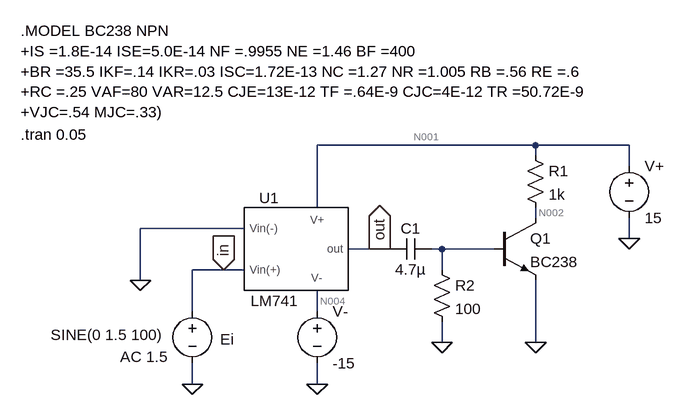
[diagram p0: schematic Schema_4-9.asc]
Schema_4-9.asc, the LTspice schematic file:
Version 4.1
SHEET 1 880 680
WIRE 592 -32 256 -32
WIRE 736 -32 592 -32
WIRE 592 -16 592 -32
WIRE 736 0 736 -32
WIRE 256 64 256 -32
WIRE 592 80 592 64
WIRE 144 96 -16 96
WIRE 736 112 736 80
WIRE 352 128 304 128
WIRE 368 128 352 128
WIRE 448 128 432 128
WIRE 528 128 448 128
WIRE 112 160 64 160
WIRE 144 160 112 160
WIRE 448 160 448 128
WIRE -16 176 -16 96
WIRE 64 224 64 160
WIRE 256 224 256 192
WIRE 448 272 448 240
WIRE 592 272 592 176
WIRE 64 336 64 304
WIRE 256 336 256 304
FLAG 592 272 0
FLAG 448 272 0
FLAG 736 112 0
FLAG 256 336 0
FLAG -16 176 0
FLAG 64 336 0
FLAG 112 160 in
IOPIN 112 160 In
FLAG 352 128 out
IOPIN 352 128 Out
SYMBOL voltage 64 208 R0
WINDOW 0 43 59 Left 2
WINDOW 3 -218 52 Left 2
WINDOW 123 -111 86 Left 2
WINDOW 39 0 0 Left 0
SYMATTR InstName Ei
SYMATTR Value SINE(0 1.5 100)
SYMATTR Value2 AC 1.5
SYMBOL cap 432 112 R90
WINDOW 0 0 32 VBottom 2
WINDOW 3 32 32 VTop 2
SYMATTR InstName C1
SYMATTR Value 4.7µ
SYMBOL voltage 736 -16 R0
SYMATTR InstName V+
SYMATTR Value 15
SYMBOL npn 528 80 R0
SYMATTR InstName Q1
SYMATTR Value BC238
SYMBOL res 576 -32 R0
SYMATTR InstName R1
SYMATTR Value 1k
SYMBOL res 432 144 R0
SYMATTR InstName R2
SYMATTR Value 100
SYMBOL voltage 256 208 R0
SYMATTR InstName V-
SYMATTR Value -15
SYMBOL LM741 192 112 R0
SYMATTR InstName U1
TEXT -200 -208 Left 2 !.MODEL BC238 NPN\n+IS =1.8E-14 ISE=5.0E-14 NF =.9955 NE =1.46 BF =400\n+BR =35.5 IKF=.14 IKR=.03 ISC=1.72E-13 NC =1.27 NR =1.005 RB =.56 RE =.6\n+RC =.25 VAF=80 VAR=12.5 CJE=13E-12 TF =.64E-9 CJC=4E-12 TR =50.72E-9\n+VJC=.54 MJC=.33)
TEXT -200 -48 Left 2 !.tran 0.05

The netlist it stands for:
* Schema_4-9.asc
V§Ei in 0 SINE(0 1.5 100) AC 1.5
C1 N003 out 4.7µ
V+ N001 0 15
Q1 N002 N003 0 0 BC238
R1 N001 N002 1k
R2 N003 0 100
V- N004 0 -15
X§U1 in 0 N001 N004 out LM741  ; pins Vin(+) Vin(-) V+ V- out
.model NPN NPN
.model PNP PNP
.lib standard.bjt
.MODEL BC238 NPN
+IS =1.8E-14 ISE=5.0E-14 NF =.9955 NE =1.46 BF =400
+BR =35.5 IKF=.14 IKR=.03 ISC=1.72E-13 NC =1.27 NR =1.005 RB =.56 RE =.6
+RC =.25 VAF=80 VAR=12.5 CJE=13E-12 TF =.64E-9 CJC=4E-12 TR =50.72E-9
+VJC=.54 MJC=.33)
.tran 0.05
.lib C:\users\kou\Documents\Electronics\Electronics_2\LM741\lm741.lib
.backanno
.end

* Results of the author's LTspice run, read from the files saved beside the schematic
* Operating Point, zero values left out:
*   V(n001) = 15 V
*   V(n002) = 15 V
*   V(out) = 13.92 V
*   V(n004) = -15 V
*   I(Ei) = -61.4 nA
*   I(V+) = -1.701 mA
*   I(R2) = 15.17 pA
*   I(R1) = 15.2 pA
*   Ic(Q1) = 15.19 pA
*   Ib(Q1) = -15.17 pA
*   I(V-) = 1.701 mA
*   Ix(u1:1) = 61.4 nA
*   Ix(u1:2) = 98.31 nA
*   Ix(u1:99) = 1.701 mA
*   Ix(u1:50) = -1.701 mA
*   Ix(u1:28) = -1.776 pA
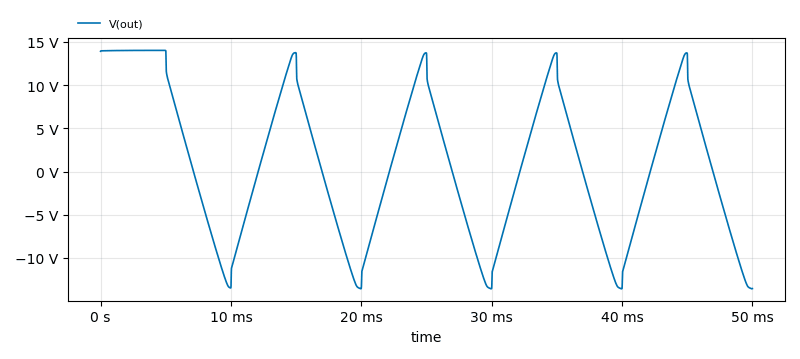
[diagram p1: Transient Analysis of Schema_4-9.asc, plotted from the saved traces]
* Transient Analysis, 1 run:
*   V(out): min -13.58 V, max 14.03 V, average 911.3 mV, rms 8.707 V, last -13.56 V